# EAGLE design tube-inner_sch-pcb (EAGLE 9.3.0)
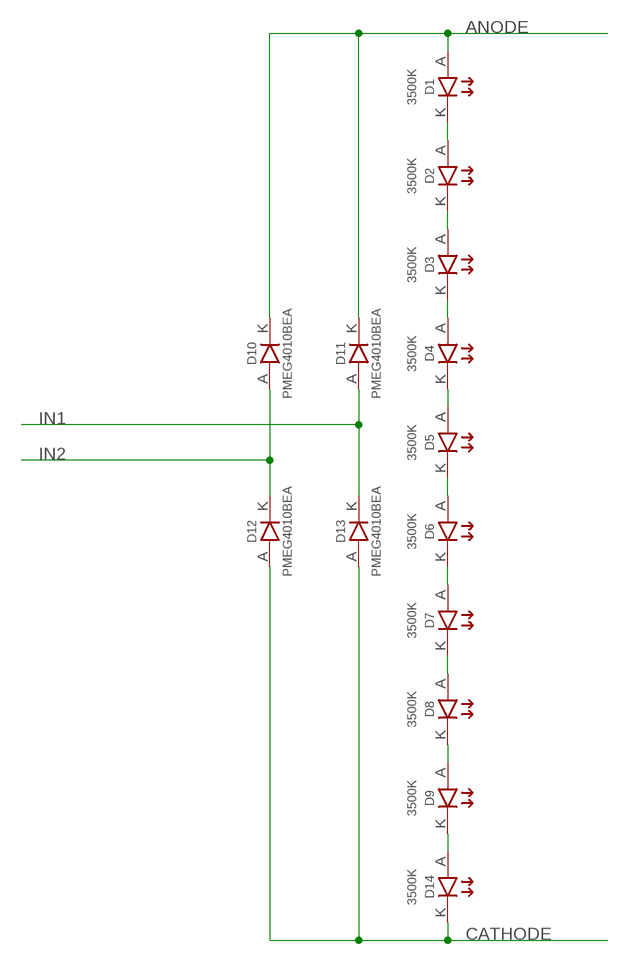
[diagram p0: schematic, sheet 1]

## Parts
D1  3500K  JE2835AWT-00-0000-0B0A0UF735E  [JE2835AWT]
D2  3500K  JE2835AWT-00-0000-0B0A0UF735E  [JE2835AWT]
D3  3500K  JE2835AWT-00-0000-0B0A0UF735E  [JE2835AWT]
D4  3500K  JE2835AWT-00-0000-0B0A0UF735E  [JE2835AWT]
D5  3500K  JE2835AWT-00-0000-0B0A0UF735E  [JE2835AWT]
D6  3500K  JE2835AWT-00-0000-0B0A0UF735E  [JE2835AWT]
D7  3500K  JE2835AWT-00-0000-0B0A0UF735E  [JE2835AWT]
D8  3500K  JE2835AWT-00-0000-0B0A0UF735E  [JE2835AWT]
D9  3500K  JE2835AWT-00-0000-0B0A0UF735E  [JE2835AWT]
D10  PMEG4010BEA  [SOD-323]
D11  PMEG4010BEA  [SOD-323]
D12  PMEG4010BEA  [SOD-323]
D13  PMEG4010BEA  [SOD-323]
D14  3500K  JE2835AWT-00-0000-0B0A0UF735E  [JE2835AWT]

## Nets
ANODE: D1.A D10.K D11.K
CATHODE: D12.A D13.A D14.K
IN1: D11.A D13.K
IN2: D10.A D12.K
N$1: D1.K D2.A
N$2: D2.K D3.A
N$3: D3.K D4.A
N$4: D5.K D6.A
N$5: D6.K D7.A
N$6: D7.K D8.A
N$7: D9.K D14.A
N$18: D8.K D9.A
N$19: D4.K D5.A

## Library data of the parts
D1-D9 D14 = OPTO:JE2835AWT-00-0000-0B0A0UF735E: LED Lighting J White, Warm 3500K 3.15V 150mA 120° 1113 (2835 Metric); DIGIKEY: JE2835AWT-00-0000-0B0A0UF735ECT-ND; HEIGHT: 0.7; PRICE_PER: 0.08
D10-D13 = DIODES:PMEG4010BEA: 1A, 40V Schottkey rectifier. SOD323.; DIGIKEY: 1727-5211-1-ND; HEIGHT: 1.2; PRICE_PER: 0.29

## Board
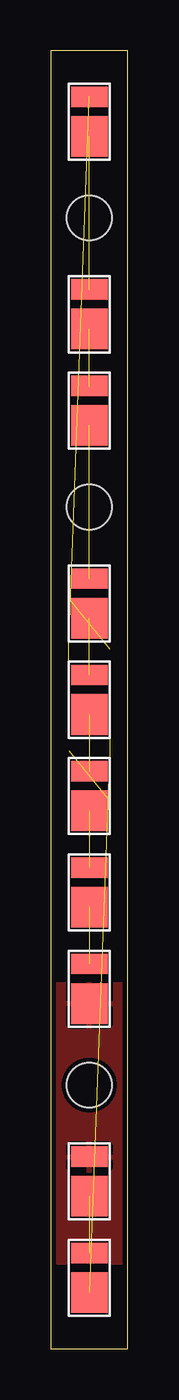
[diagram p1: board, top side]
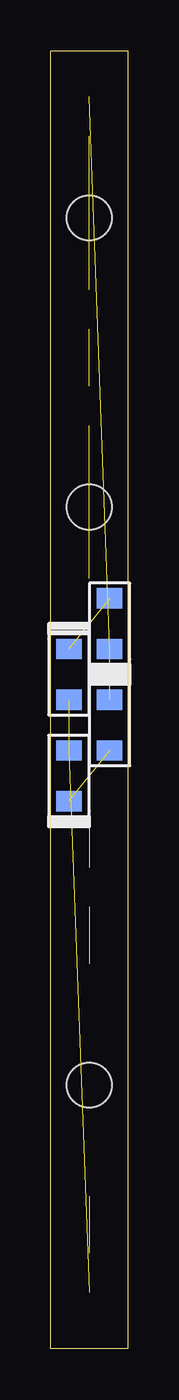
[diagram p2: board, bottom side, seen from below]

Size 3.8 x 64 mm. Coordinates in mm from the lower left corner, seen from the top.
Outline: 0,64 0,0 3.8,0 3.8,64 0,64
Copper layers (1*2*3*16): Top 0.035mm / dielectric 0.31mm / Route2 0.035mm / dielectric 0.15mm / Route3 0.035mm / dielectric 0.2mm / Bottom 0.035mm
Design rules "myDRC 4 layers 0.15mm *": minimum track width 0.15mm, minimum drill 0.25mm, track to track 0.15mm, track to pad 0.15mm, pad to pad 0.15mm, via to via 0.15mm, smd to smd 0mil, copper to edge 0.25mm, drill to drill 0.25mm, minimum pad ring 10mil, minimum via ring 3mil, stop-mask expansion 4mil, vias tented up to drill 1mm, thermal gap 10mil
Holes 2.2 mm at 1.9,41.5 1.9,13 1.9,55.75

### Footprints (pad centres in the part's own frame; a part is rotated, then mirrored left to right if it is on the bottom)
JE2835AWT = smd 1 x 1.8: A 1.225,0 | smd 2 x 1.8: K -0.725,0
SOD-323 = smd 1 x 1.25: A -1.25,0; K 1.25,0

### Placement (x,y rotation side)
D1  1.9,60.5 90 top
D2  1.9,51 90 top
D3  1.9,46.25 90 top
D4  1.9,36.75 90 top
D5  1.9,32 90 top
D6  1.9,27.25 90 top
D7  1.9,22.5 90 top
D8  1.9,17.75 90 top
D9  1.9,8.25 90 top
D10  0.9,30.75 90 bottom
D11  0.9,35.75 270 bottom
D12  2.9,28.25 270 bottom
D13  2.9,33.25 90 bottom
D14  1.9,3.5 90 top

### Tracks (layer width: path | path; a pad name or v marks a point on that pad's centre or on a via)
ANODE  (2 unrouted)
CATHODE  (2 unrouted)
IN1  (1 unrouted)
IN2  (1 unrouted)
N$1  (1 unrouted)
N$2  (1 unrouted)
N$3  (1 unrouted)
N$4  (1 unrouted)
N$5  (1 unrouted)
N$6  (1 unrouted)
N$7  (1 unrouted)
N$18
  pour Top: 3.9,9 3.9,18 -0.1,18 -0.1,9
  pour Top: 3.9,4.25 3.9,13.25 -0.1,13.25 -0.1,4.25
  pour Top: 3.9,-0.5 3.9,8.5 -0.1,8.5 -0.1,-0.5
N$19  (1 unrouted)